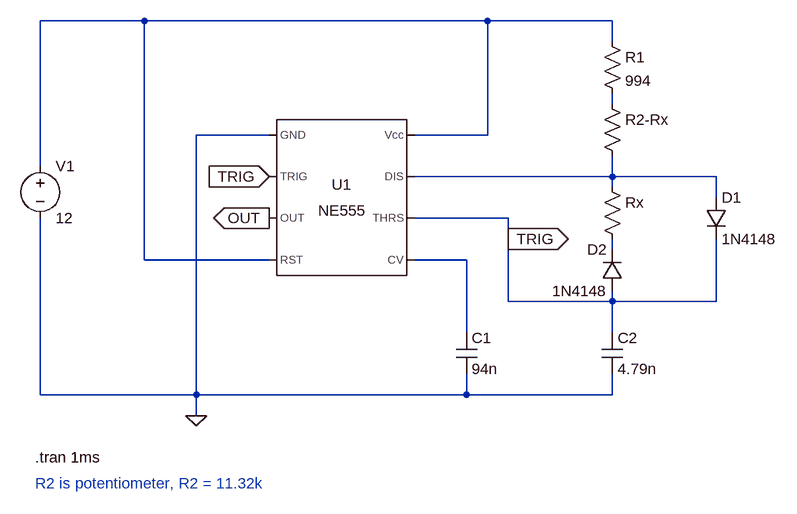
[diagram p0: schematic PWM.asc]
PWM.asc, the LTspice schematic file:
Version 4
SHEET 1 1344 696
WIRE -32 -128 -192 -128
WIRE 496 -128 -32 -128
WIRE 688 -128 496 -128
WIRE 688 -96 688 -128
WIRE 688 0 688 -16
WIRE 160 48 48 48
WIRE 496 48 496 -128
WIRE 496 48 384 48
WIRE -192 96 -192 -128
WIRE 688 112 688 80
WIRE 688 112 384 112
WIRE 848 112 688 112
WIRE 688 128 688 112
WIRE 848 144 848 112
WIRE 528 176 384 176
WIRE 528 208 528 176
WIRE 688 224 688 208
WIRE -32 240 -32 -128
WIRE 160 240 -32 240
WIRE 464 240 384 240
WIRE 528 304 528 208
WIRE 688 304 688 288
WIRE 688 304 528 304
WIRE 848 304 848 208
WIRE 848 304 688 304
WIRE 464 352 464 240
WIRE 688 352 688 304
WIRE -192 448 -192 176
WIRE 48 448 48 48
WIRE 48 448 -192 448
WIRE 464 448 464 416
WIRE 464 448 48 448
WIRE 688 448 688 416
WIRE 688 448 464 448
WIRE 48 480 48 448
FLAG 528 208 TRIG
IOPIN 528 208 Out
FLAG 160 176 OUT
IOPIN 160 176 Out
FLAG 160 112 TRIG
IOPIN 160 112 In
FLAG 48 480 0
SYMBOL Misc\\NE555 272 144 R0
SYMATTR InstName U1
SYMBOL voltage -192 80 R0
WINDOW 123 0 0 Left 2
WINDOW 39 0 0 Left 2
SYMATTR InstName V1
SYMATTR Value 12
SYMBOL cap 448 352 R0
SYMATTR InstName C1
SYMATTR Value 94n
SYMBOL res 672 -16 R0
WINDOW 3 36 68 Left 2
SYMATTR InstName R2-Rx
SYMATTR Value ""
SYMBOL res 672 -112 R0
SYMATTR InstName R1
SYMATTR Value 994
SYMBOL res 672 112 R0
WINDOW 3 36 68 Left 2
SYMATTR InstName Rx
SYMATTR Value ""
SYMBOL diode 832 144 R0
SYMATTR InstName D1
SYMATTR Value 1N4148
SYMBOL diode 704 288 R180
WINDOW 0 24 64 Left 2
WINDOW 3 24 0 Left 2
SYMATTR InstName D2
SYMATTR Value 1N4148
SYMBOL cap 672 352 R0
SYMATTR InstName C2
SYMATTR Value 4.79n
TEXT -200 544 Left 2 !.tran 1ms
TEXT -200 584 Left 2 ;R2 is potentiometer, R2 = 11.32k

The netlist it stands for:
* PWM.asc
XU1 0 TRIG OUT N001 N005 TRIG N003 N001 NE555  ; pins GND TRIG OUT RST CV THRS DIS Vcc
V1 N001 0 12
C1 N005 0 94n
R2-Rx N002 N003
R1 N001 N002 994
Rx N003 N004
D1 N003 TRIG 1N4148
D2 TRIG N004 1N4148
C2 TRIG 0 4.79n
.model D D
.lib standard.dio
.tran 1ms
* R2 is potentiometer, R2 = 11.32k
.lib NE555.sub
.backanno
.end